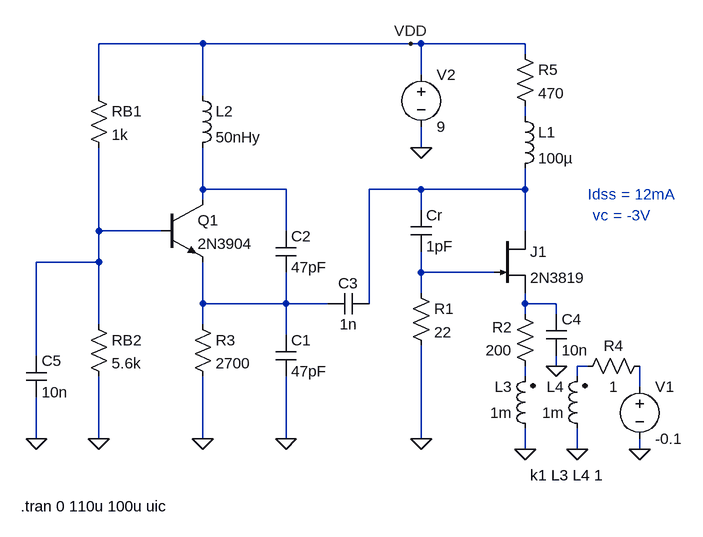
[diagram p0: schematic fetreactancia.asc]
fetreactancia.asc, the LTspice schematic file:
Version 4
SHEET 1 880 712
WIRE -128 -64 -288 -64
WIRE 192 -64 -128 -64
WIRE 208 -64 192 -64
WIRE 368 -64 208 -64
WIRE 368 -48 368 -64
WIRE 208 -16 208 -64
WIRE -288 16 -288 -64
WIRE -128 16 -128 -64
WIRE 368 48 368 32
WIRE 208 96 208 64
WIRE -128 160 -128 96
WIRE 0 160 -128 160
WIRE 208 160 128 160
WIRE 368 160 368 128
WIRE 368 160 208 160
WIRE -128 176 -128 160
WIRE 208 192 208 160
WIRE -288 224 -288 96
WIRE -192 224 -288 224
WIRE 0 224 0 160
WIRE 368 224 368 160
WIRE -288 272 -288 224
WIRE -288 272 -384 272
WIRE 208 288 208 256
WIRE 320 288 208 288
WIRE 208 320 208 288
WIRE -128 336 -128 272
WIRE 0 336 0 288
WIRE 0 336 -128 336
WIRE 64 336 0 336
WIRE 128 336 128 160
WIRE 368 336 368 320
WIRE 416 336 368 336
WIRE 368 352 368 336
WIRE 416 352 416 336
WIRE -288 368 -288 272
WIRE -128 368 -128 336
WIRE 0 384 0 336
WIRE -384 416 -384 272
WIRE 416 432 416 416
WIRE 464 432 448 432
WIRE 368 448 368 432
WIRE 448 448 448 432
WIRE 544 464 544 432
WIRE -384 544 -384 480
WIRE -288 544 -288 448
WIRE -128 544 -128 448
WIRE 0 544 0 448
WIRE 208 544 208 400
WIRE 368 560 368 528
WIRE 448 560 448 528
WIRE 544 560 544 544
FLAG 208 544 0
FLAG 368 560 0
FLAG 448 560 0
FLAG -128 544 0
FLAG -288 544 0
FLAG -384 544 0
FLAG 0 544 0
FLAG 192 -64 VDD
FLAG 544 560 0
FLAG 208 96 0
FLAG 416 432 0
SYMBOL ind -144 0 R0
SYMATTR InstName L2
SYMATTR Value 50nHy
SYMBOL cap 192 192 R0
SYMATTR InstName Cr
SYMATTR Value 1pF
SYMBOL res 192 304 R0
SYMATTR InstName R1
SYMATTR Value 22
SYMBOL ind2 384 544 R180
WINDOW 0 36 80 Left 2
WINDOW 3 36 40 Left 2
SYMATTR InstName L3
SYMATTR Value 1m
SYMATTR Type ind
SYMBOL ind2 464 544 R180
WINDOW 0 36 80 Left 2
WINDOW 3 36 40 Left 2
SYMATTR InstName L4
SYMATTR Value 1m
SYMATTR Type ind
SYMBOL res -144 352 R0
SYMATTR InstName R3
SYMATTR Value 2700
SYMBOL res -304 352 R0
SYMATTR InstName RB2
SYMATTR Value 5.6k
SYMBOL res -304 0 R0
SYMATTR InstName RB1
SYMATTR Value 1k
SYMBOL cap -16 384 R0
SYMATTR InstName C1
SYMATTR Value 47pF
SYMBOL cap -16 224 R0
SYMATTR InstName C2
SYMATTR Value 47pF
SYMBOL njf 320 224 R0
SYMATTR InstName J1
SYMATTR Value 2N3819
SYMBOL cap -400 416 R0
SYMATTR InstName C5
SYMATTR Value 10n
SYMBOL voltage 544 448 R0
WINDOW 123 0 0 Left 0
WINDOW 39 24 124 Left 2
SYMATTR InstName V1
SYMATTR Value -0.1
SYMBOL voltage 208 -32 R0
WINDOW 123 0 0 Left 0
WINDOW 39 0 0 Left 0
SYMATTR InstName V2
SYMATTR Value 9
SYMBOL cap 128 320 R90
WINDOW 0 0 32 VBottom 2
WINDOW 3 32 32 VTop 2
SYMATTR InstName C3
SYMATTR Value 1n
SYMBOL res 560 416 R90
WINDOW 0 0 56 VBottom 2
WINDOW 3 32 56 VTop 2
SYMATTR InstName R4
SYMATTR Value 1
SYMBOL res 384 448 R180
WINDOW 0 36 76 Left 2
WINDOW 3 36 40 Left 2
SYMATTR InstName R2
SYMATTR Value 200
SYMBOL cap 400 352 R0
SYMATTR InstName C4
SYMATTR Value 10n
SYMBOL res 352 -64 R0
SYMATTR InstName R5
SYMATTR Value 470
SYMBOL ind 352 32 R0
SYMATTR InstName L1
SYMATTR Value 100µ
SYMBOL npn -192 176 R0
SYMATTR InstName Q1
SYMATTR Value 2N3904
TEXT 376 600 Left 2 !k1 L3 L4 1
TEXT -408 648 Left 2 !.tran 0 110u 100u uic
TEXT 464 168 Left 2 ;Idss = 12mA
TEXT 472 200 Left 2 ;vc = -3V

The netlist it stands for:
* fetreactancia.asc
L2 VDD N002 50nHy
Cr N003 N005 1pF
R1 N005 0 22
L3 0 N009 1m
L4 0 N008 1m
R3 N006 0 2700
RB2 N004 0 5.6k
RB1 VDD N004 1k
C1 N006 0 47pF
C2 N002 N006 47pF
J1 N003 N005 N007 2N3819
C5 N004 0 10n
V1 N010 0 -0.1
V2 VDD 0 9
C3 N003 N006 1n
R4 N010 N008 1
R2 N009 N007 200
C4 N007 0 10n
R5 VDD N001 470
L1 N001 N003 100µ
Q1 N002 N004 N006 0 2N3904
.model NPN NPN
.model PNP PNP
.lib standard.bjt
.model NJF NJF
.model PJF PJF
.lib standard.jft
k1 L3 L4 1
.tran 0 110u 100u uic
* Idss = 12mA
* vc = -3V
.backanno
.end